# EAGLE schematic Control PCB v37 (EAGLE 9.7.0)
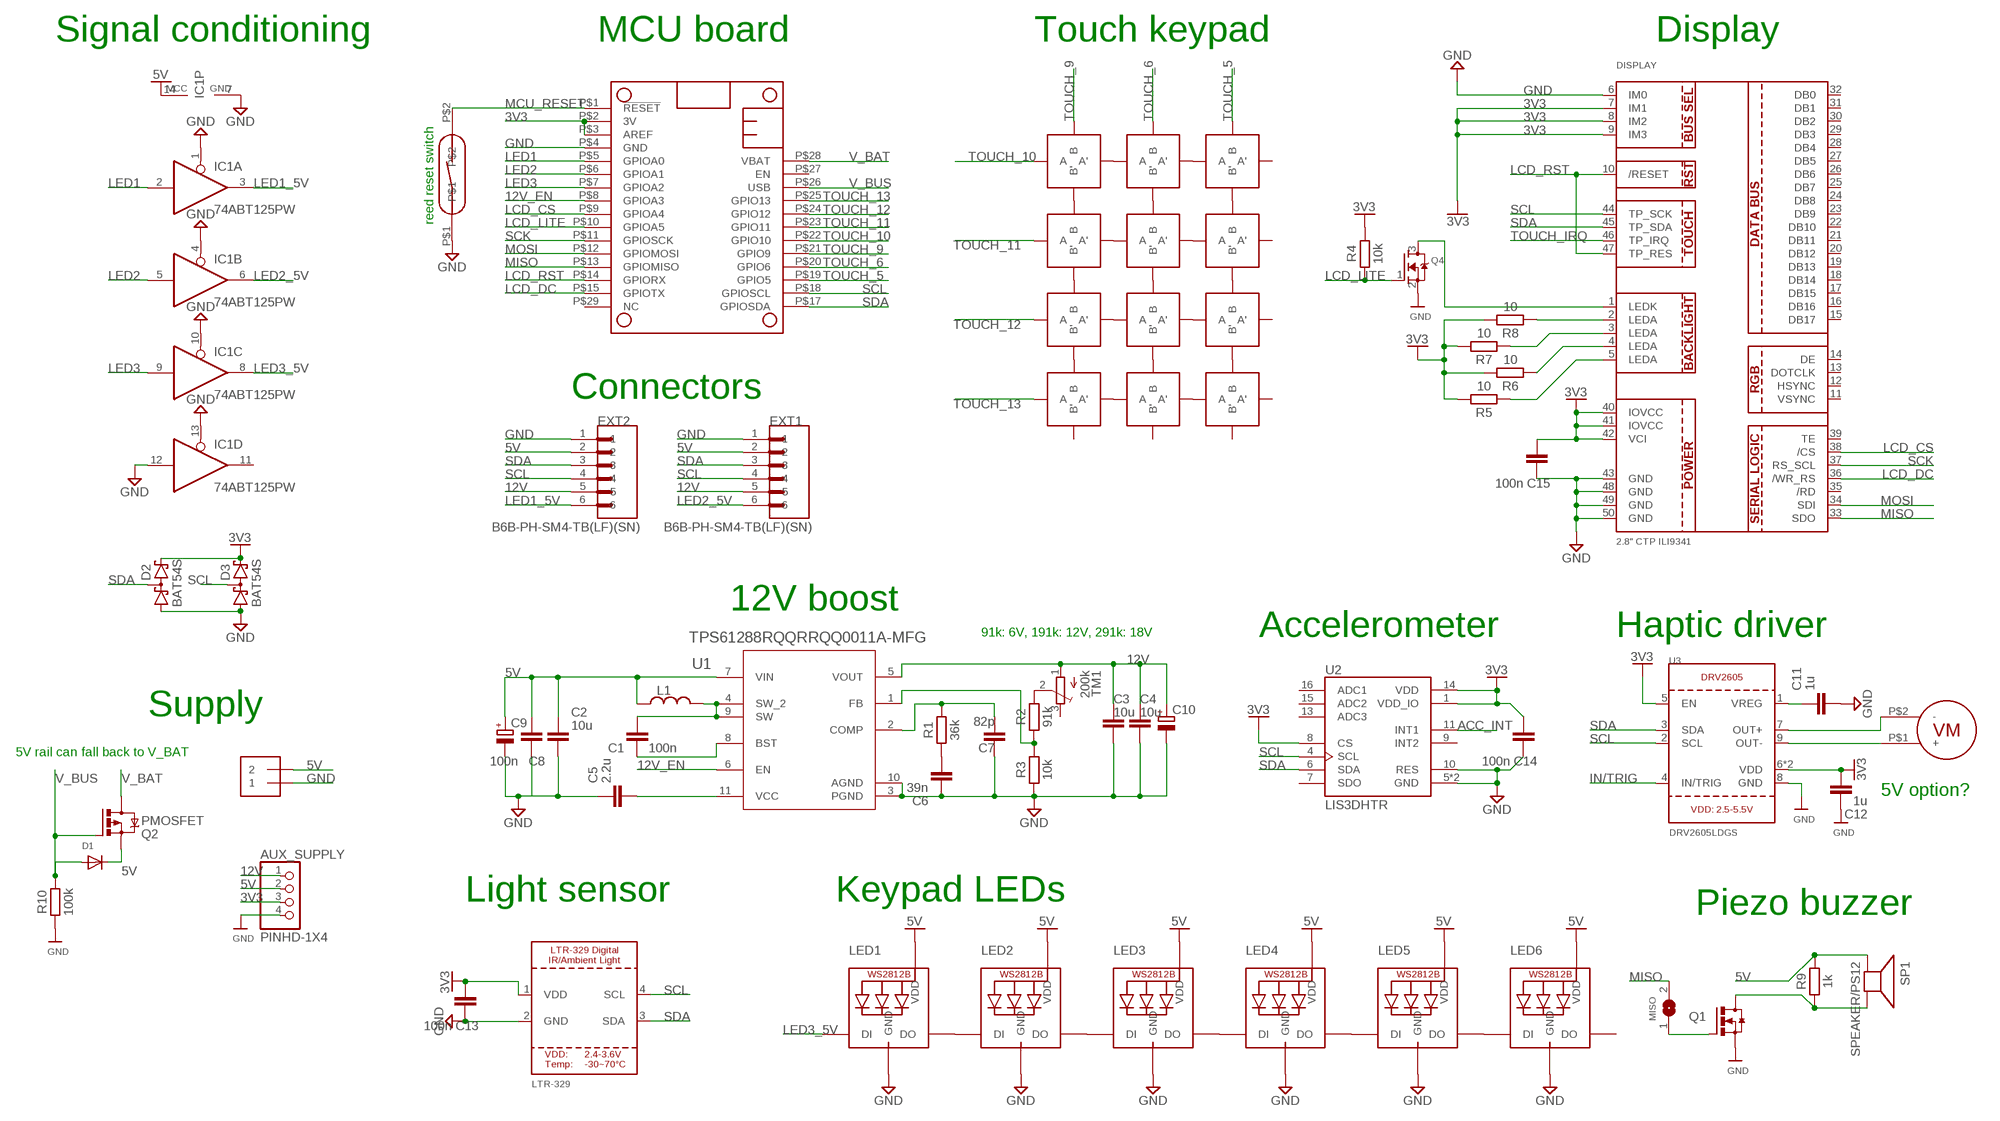
[diagram p0: schematic, sheet 1]

## Parts
0  TOUCH_MATRIX_BUTTON  [TOUCH_MATRIX_BUTTON]
1  TOUCH_MATRIX_BUTTON  [TOUCH_MATRIX_BUTTON]
2  TOUCH_MATRIX_BUTTON  [TOUCH_MATRIX_BUTTON]
3  TOUCH_MATRIX_BUTTON  [TOUCH_MATRIX_BUTTON]
4  TOUCH_MATRIX_BUTTON  [TOUCH_MATRIX_BUTTON]
5  TOUCH_MATRIX_BUTTON  [TOUCH_MATRIX_BUTTON]
6  TOUCH_MATRIX_BUTTON  [TOUCH_MATRIX_BUTTON]
7  TOUCH_MATRIX_BUTTON  [TOUCH_MATRIX_BUTTON]
8  TOUCH_MATRIX_BUTTON  [TOUCH_MATRIX_BUTTON]
9  TOUCH_MATRIX_BUTTON  [TOUCH_MATRIX_BUTTON]
AUX_SUPPLY  PINHD-1X4  [1X04]
C1  100n  C_CHIP-0603(1608-METRIC)  [CAPC1608X85]
C2  10u  C_CHIP-1206(3216-METRIC)  [CAPC3216X135]
C3  10u  C_CHIP-1206(3216-METRIC)  [CAPC3216X135]
C4  10u  C_CHIP-1206(3216-METRIC)  [CAPC3216X135]
C5  2.2u  C_CHIP-0603(1608-METRIC)  [CAPC1608X85]
C6  39n  C_CHIP-0603(1608-METRIC)  [CAPC1608X85]
C7  82p  C_CHIP-0603(1608-METRIC)  [CAPC1608X85]
C8  100n  C_CHIP-0603(1608-METRIC)  [CAPC1608X85]
C9  C-POL_ECAP-8.5MM  [CAPAE830X1050N]
C10  C-POL_ECAP-8.5MM  [CAPAE830X1050N]
C11  1u  C_CHIP-0603(1608-METRIC)  [CAPC1608X85]
C12  1u  C_CHIP-0603(1608-METRIC)  [CAPC1608X85]
C13  100n  C_CHIP-0603(1608-METRIC)  [CAPC1608X85]
C14  100n  C_CHIP-0603(1608-METRIC)  [CAPC1608X85]
C15  100n  C_CHIP-0603(1608-METRIC)  [CAPC1608X85]
D1  DIODE_SOD-123FL  [SOD-123FL]
D2  BAT54S  [SOT23]
D3  BAT54S  [SOT23]
DISPLAY  2.8" CTP ILI9341  DISP_LCD_CTP28_SAMPLE  [TFT_2.83IN_240X320_50PIN]
ESC  TOUCH_MATRIX_BUTTON  [TOUCH_MATRIX_BUTTON]
EXT1  B6B-PH-SM4-TB(LF)(SN)  [JST_B6B-PH-SM4-TB(LF)(SN)]
EXT2  B6B-PH-SM4-TB(LF)(SN)  [JST_B6B-PH-SM4-TB(LF)(SN)]
IC1  74ABT125PW  [TSSOP14]
J1  1X2-3.5MM  [1X2-3.5MM]
L1  LMOLDED(7.2*6.9)  [INDM7269X280]
LED1  SK6812  [4020]
LED2  SK6812  [4020]
LED3  SK6812  [4020]
LED4  SK6812  [4020]
LED5  SK6812  [4020]
LED6  SK6812  [4020]
MCU  FEATHERSMD  [FEATHERWING_SMD]
MISO  SOLDERJUMPER  [SOLDERJUMPER_ARROW_NOPASTE]
OK  TOUCH_MATRIX_BUTTON  [TOUCH_MATRIX_BUTTON]
Q1  MOSFET-N  [SOT23-3]
Q2  PMOSFET  PMOSFET_SOT23-GSD  [SOT23]
Q4  BSS138  MOSFET-NWIDE  [SOT23-WIDE]
R1  36k  R_CHIP-0603(1608-METRIC)  [RESC1608X60]
R2  91k  R_CHIP-0603(1608-METRIC)  [RESC1608X60]
R3  10k  R_CHIP-0603(1608-METRIC)  [RESC1608X60]
R4  10k  R_CHIP-0603(1608-METRIC)  [RESC1608X60]
R5  10  R_CHIP-0603(1608-METRIC)  [RESC1608X60]
R6  10  R_CHIP-0603(1608-METRIC)  [RESC1608X60]
R7  10  R_CHIP-0603(1608-METRIC)  [RESC1608X60]
R8  10  R_CHIP-0603(1608-METRIC)  [RESC1608X60]
R9  1k  R_CHIP-0603(1608-METRIC)  [RESC1608X60]
R10  100k  R_CHIP-0603(1608-METRIC)  [RESC1608X60]
RS  REEDSWITCH  [AXIAL_20MM]
SP1  SPEAKER/PS12  [PS12]
TM1  200k  POTENTIOMETER  [TC33X]
U1  TPS61288RQQRRQQ0011A-MFG  [RQQ0011A-MFG]
U2  LIS3DHTR  [LGA-16]
U3  DRV2605LDGS  DRV2605_SOP  [PSOP10]
U4  LTR-329  [LTR-329]
U$2  VIBRATION_MOTOR  [VG0832014L]

## Nets
3V3: AUX_SUPPLY.3 C12.2 C13.2 C14.2 C15.2 D2.2(C2) D3.2(C2) DISPLAY.7(IM1) DISPLAY.8(IM2) DISPLAY.9(IM3) DISPLAY.40(IOVCC) DISPLAY.41(IOVCC) DISPLAY.42(VCI) MCU.P$2(3V) MCU.P$3(AREF) R4.2 R5.2 R6.2 R7.2 R8.2 U2.1(VDD_IO) U2.8(CS) U2.14(VDD) U3.5(EN) U3.6(VDD) U3.10(VDD) U4.1(VDD)
5V: AUX_SUPPLY.2 C2.1 C8.2 C9.1(+) D1.C EXT1.2 EXT2.2 IC1.14(P:VCC) J1.2 L1.1 LED1.VDD LED2.VDD LED3.VDD LED4.VDD LED5.VDD LED6.VDD Q2.2(S) R9.2 SP1.P$1(+) U1.7(VIN)
12V: AUX_SUPPLY.1 C3.1 C4.1 C10.1(+) EXT1.5 EXT2.5 TM1.1(A) U1.5(VOUT)
12V_EN: MCU.P$8(GPIOA3) U1.6(EN)
ACC_INT: U2.11(INT1)
GND: AUX_SUPPLY.4 C2.2 C3.2 C4.2 C5.1 C6.1 C7.1 C8.1 C9.2(-) C10.2(-) C11.2 C12.1 C13.1 C14.1 C15.1 D2.1(A1) D3.1(A1) DISPLAY.6(IM0) DISPLAY.43(GND) DISPLAY.48(GND) DISPLAY.49(GND) DISPLAY.50(GND) EXT1.1 EXT2.1 IC1.1(A:OE) IC1.4(B:OE) IC1.7(P:GND) IC1.10(C:OE) IC1.12(D:I) IC1.13(D:OE) J1.1 LED1.GND LED2.GND LED3.GND LED4.GND LED5.GND LED6.GND MCU.P$4(GND) Q1.2(S) Q4.2(S) R3.1 R10.1 RS.P$1 U1.3(PGND) U1.10(AGND) U2.5(GND) U2.10(RES) U2.12(GND) U3.8(GND) U4.2(GND)
IN/TRIG: U3.4(IN/TRIG)
LCD_CS: DISPLAY.38(/CS) MCU.P$9(GPIOA4)
LCD_DC: DISPLAY.36(/WR_RS) MCU.P$15(GPIOTX)
LCD_LITE: MCU.P$10(GPIOA5) Q4.1(G) R4.1
LCD_RST: DISPLAY.10(/RESET) DISPLAY.47(TP_RES) MCU.P$14(GPIORX)
LED1: IC1.2(A:I) MCU.P$5(GPIOA0)
LED1_5V: EXT2.6 IC1.3(A:O)
LED2: IC1.5(B:I) MCU.P$6(GPIOA1)
LED2_5V: EXT1.6 IC1.6(B:O)
LED3: IC1.9(C:I) MCU.P$7(GPIOA2)
LED3_5V: IC1.8(C:O) LED1.DIN(DI)
MCU_RESET: MCU.P$1(!RESET) RS.P$2
MISO: DISPLAY.33(SDO) MCU.P$13(GPIOMISO) MISO.2
MOSI: DISPLAY.34(SDI) MCU.P$12(GPIOMOSI)
N$1: 7.A' 8.A
N$2: DISPLAY.5(LEDA) R5.1
N$3: DISPLAY.2(LEDA) R8.1
N$4: C1.1 U1.8(BST)
N$5: C5.2 U1.11(VCC)
N$6: C6.2 R1.1
N$7: C1.2 L1.2 U1.4(SW_2) U1.9(SW)
N$8: DISPLAY.3(LEDA) R7.1
N$9: C7.2 R1.2 U1.2(COMP)
N$10: DISPLAY.4(LEDA) R6.1
N$11: R2.2 TM1.2(S)
N$12: R2.1 R3.2 U1.1(FB)
N$13: DISPLAY.1(LEDK) Q4.3(D)
N$14: 8.A' 9.A
N$15: 4.A' 5.A
N$16: 5.A' 6.A
N$17: 4.B' 7.B
N$18: 7.B' ESC.B
N$19: 5.B' 8.B
N$20: 1.A' 2.A
N$21: 2.A' 3.A
N$22: 0.B 8.B'
N$23: 6.B' 9.B
N$24: 9.B' OK.B
N$25: 0.A ESC.A'
N$26: 0.A' OK.A
N$27: 1.B' 4.B
N$28: 2.B' 5.B
N$29: 3.B' 6.B
N$30: C11.1 U3.1(VREG)
N$31: U3.9(OUT-) U$2.P$1(+)
N$32: LED1.DOUT(DO) LED2.DIN(DI)
N$33: U3.7(OUT+) U$2.P$2(-)
N$34: LED5.DOUT(DO) LED6.DIN(DI)
N$35: LED4.DOUT(DO) LED5.DIN(DI)
N$36: LED2.DOUT(DO) LED3.DIN(DI)
N$37: LED3.DOUT(DO) LED4.DIN(DI)
N$38: Q1.3(D) R9.1 SP1.P$2(-)
N$39: MISO.1 Q1.1(G)
SCK: DISPLAY.37(RS_SCL) MCU.P$11(GPIOSCK)
SCL: D3.3(C1A2) DISPLAY.44(TP_SCK) EXT1.4 EXT2.4 MCU.P$18(GPIOSCL) U2.4(SCL) U3.2(SCL) U4.4(SCL)
SDA: D2.3(C1A2) DISPLAY.45(TP_SDA) EXT1.3 EXT2.3 MCU.P$17(GPIOSDA) U2.6(SDA) U3.3(SDA) U4.3(SDA)
TOUCH_5: 3.B MCU.P$19(GPIO5)
TOUCH_6: 2.B MCU.P$20(GPIO6)
TOUCH_9: 1.B MCU.P$21(GPIO9)
TOUCH_10: 1.A MCU.P$22(GPIO10)
TOUCH_11: 4.A MCU.P$23(GPIO11)
TOUCH_12: 7.A MCU.P$24(GPIO12)
TOUCH_13: ESC.A MCU.P$25(GPIO13)
TOUCH_IRQ: DISPLAY.46(TP_IRQ)
V_BAT: MCU.P$28(VBAT) Q2.3(D)
V_BUS: D1.A MCU.P$26(USB) Q2.1(G) R10.2
Unconnected: 0.B' 3.A' 6.A' 9.A' DISPLAY.11(VSYNC) DISPLAY.12(HSYNC) DISPLAY.13(DOTCLK) DISPLAY.14(DE) DISPLAY.15(DB17) DISPLAY.16(DB16) DISPLAY.17(DB15) DISPLAY.18(DB14) DISPLAY.19(DB13) DISPLAY.20(DB12) DISPLAY.21(DB11) DISPLAY.22(DB10) DISPLAY.23(DB9) DISPLAY.24(DB8) DISPLAY.25(DB7) DISPLAY.26(DB6) DISPLAY.27(DB5) DISPLAY.28(DB4) DISPLAY.29(DB3) DISPLAY.30(DB2) DISPLAY.31(DB1) DISPLAY.32(DB0) DISPLAY.35(/RD) DISPLAY.39(TE) ESC.B' IC1.11(D:O) LED6.DOUT(DO) MCU.P$27(EN) MCU.P$29(NC) OK.A' OK.B' TM1.3(E) U2.7(SDO) U2.9(INT2) U2.13(ADC3) U2.15(ADC2) U2.16(ADC1)

## Notes on the sheet
- Signal conditioning | MCU board | Touch keypad | Display
- reed reset switch
- Connectors
- 12V boost
- Accelerometer | Haptic driver
- 91k: 6V, 191k: 12V, 291k: 18V
- Supply
- 5V rail can fall back to V_BAT
- 5V option?
- Light sensor | Keypad LEDs
- Piezo buzzer

## Library data of the parts
0 1-9 ESC OK = ZE PCB lib v51:TOUCH_MATRIX_BUTTON
AUX_SUPPLY = MAS AT PCB library:PINHD-1X4: PIN HEADER; CATEGORY: CONNECTOR; SUB-CATEGORY: PIN-HEADER
C1-C8 C11-C15 = Capacitor:C: Capacitor - Generic; CATEGORY: Capacitor
C9 C10 = Capacitor:C-POL: Capacitor Polarised - Generic; CATEGORY: Capacitor
D1 = adafruit:DIODE: Diode SMADIODE - SMA Surface Mount Package 20V 1A Schottky Diode Digikey: 641-1014-6-ND DO-1N4148 - Through Hole Small Current Diode SOD-123 20V 1 A (.5mV Vf) Schottky Diode - Digikey: MBRX120TPMSCT-ND SOD-323 10V 570mA (.38mV Vf, 3ns) Schottky Diode - Digikey: ZLLS410CT-ND SOD-523 30V 30mA Schottky Diode (RB751S-40TE61) - Digikey: RB751S-40TE61CT-ND SOT23-R/W - SOT23 Package (R = Solder Paste/Reflow Ovens, W = Hand-Soldering) BAT54Film 40V 300mA - Digikey: 497-7162-1-ND
D2 D3 = diode:BAT54S: Schottky Diodes Pin connection corrected 2011-05-04 Source: Fairchild .. BAT54.pdf
DISPLAY = microbuilder:DISP_LCD_CTP28: 2.83" 240x320 Pixel Capacitive Touch Display
EXT1 EXT2 = B6B-PH-SM4-TB_LF__SN_:B6B-PH-SM4-TB(LF)(SN): PH Series 2 mm Pitch 6 Position SMT Single Row Top Entry Shrouded Header; MANUFACTURER: JST
IC1 = 74xx-eu:74*125: Quad bus BUFFER, 3-state
J1 = adafruit:1X2: 3.5mm Terminal block http://www.ladyada.net/library/pcb/eaglelibrary.html
L1 = ZE PCB lib v51:L: Inductor Fixed - Generic
LED1-LED6 = ZE PCB lib v51:SK6812
MCU = ZE PCB lib v51:FEATHER
MISO = microbuilder:SOLDERJUMPER: SMD Solder JUMPER Solder the two pads together to create a connection, or remove the solder to break it. REFLOW - Use this footprint for solder paste and reflow ovens. WAVE - Use this footprint for hand-soldering (larger pads). CLOSED - Has a trace between the two pads to ensure it is closed by default. The trace needs to be cut to disable the jumper, and can be closed again by creating a solder bridge between the two pads.; BOM: EXCLUDE
Q1 = MAS AT PCB library:MOSFET-N: MOSFET N-CH 60V 300MA SOT-23 Manufacturer's datasheet <https://assets.nexperia.com/documents/data-sheet/2N7002.pdf>; CREATED_BY: PCBLayout.com; DIGIKEY_PART_NUMBER: 1727-2764-1-ND; MANUFACTURER: Nexperia USA Inc.; MPN: 2N7002,215; PACKAGE: SOT-23-3
Q2 = Transistor:PMOSFET: P-Channel MOSFET - Generic; CATEGORY: Transistor; SUB-CATEGORY: MOSFET; TYPE: P-Channel
Q4 = microbuilder:MOSFET-N: N-Channel Mosfet LEGEND VDS: Voltage Drain-Source ID: Drain Current RDS(ON): Drain-Source On-State Resistance VGS(TH): Gate-Source Threshold Voltage CISS: Drain-Source Input Capacitance SOT-23 Name VDS ID RDS(ON) VGS(TH) CISS Order Number 2N7002E 60V 260mA 2.5 Ohm 2.5V @ 250uA 26.7pF @ 25V 2N7002ET1GOSTR-ND BSH103 30V 850mA 400 mOhm 400mV @ 1mA 83pF @ 24V BSH103,235-ND BSS138 60V 320mA 1.6 Ohm 1.5V @ 250uA 50pF @ 10V Mouser: 771-BSS138PW115 DMN2075U-7 20V 4.2A 38 mOhm 1V @ 250 uA 594.3pF @ 10V DMN2075U-7DICT-ND * BSS138 good choice for I2C level-shifting POWERPAK 1212-8 Name VDS ID RDS(ON) VGS(TH) CISS Order Number Si7308DN 60V 6A 58 mOhm 3V @ 250uA 665pF @ 15V SI7308DN-T1-E3CT-ND
R1-R10 = Resistor:R: Resistor Fixed - Generic; CATEGORY: Resistor; SUB-CATEGORY: Fixed
RS = ZE PCB lib v51:REEDSWITCH
SP1 = adafruit:SPEAKER: SPEAKER Source: Buerklin Added PS12 (for part # PS1240 piezo) http://www.ladyada.net/library/pcb/eaglelibrary.html
TM1 = MAS AT PCB library v11:POTENTIOMETER: SMT trimmer potentiometer part number TC33X http://www.ladyada.net/library/eagle
U1 = 2023-08-09_12-29-33_Library:TPS61288RQQR; COPYRIGHT: Copyright (C) 2023 Ultra Librarian. All rights reserved.; DIGI-KEY_PART_NUMBER_1: 296-TPS61288RQQRCT-ND; DIGI-KEY_PART_NUMBER_2: 296-TPS61288RQQRDKR-ND; DIGI-KEY_PART_NUMBER_3: 296-TPS61288RQQRTR-ND; MANUFACTURER_PART_NUMBER: TPS61288RQQR; MFR_NAME: Texas Instruments; REFDES: RefDes; TYPE: TYPE
U2 = MAS AT PCB library:LIS3DHTR: ACCEL 2-16G I2C/SPI 16LGA Manufacturer's datasheet <https://www.st.com/content/ccc/resource/technical/document/datasheet/3c/ae/50/85/d6/b1/46/fe/CD00274221.pdf/files/CD00274221.pdf/jcr:content/translations/en.CD00274221.pdf>; CREATED_BY: PCBLayout.com; DIGIKEY_PN: 497-10613-2-ND; MANUFACTURER: STMicroelectronics; MPN: LIS3DHTR; PACKAGE: LGA-16
U3 = microbuilder:DRV2605: DRV2605 - Haptic Driver for ERM/LRA Motors
U4 = adafruit_sensor:LTR-329
U$2 = ZE PCB lib v51:VIBRATION_MOTOR